# EAGLE design pico8enc (EAGLE 9.6.2)
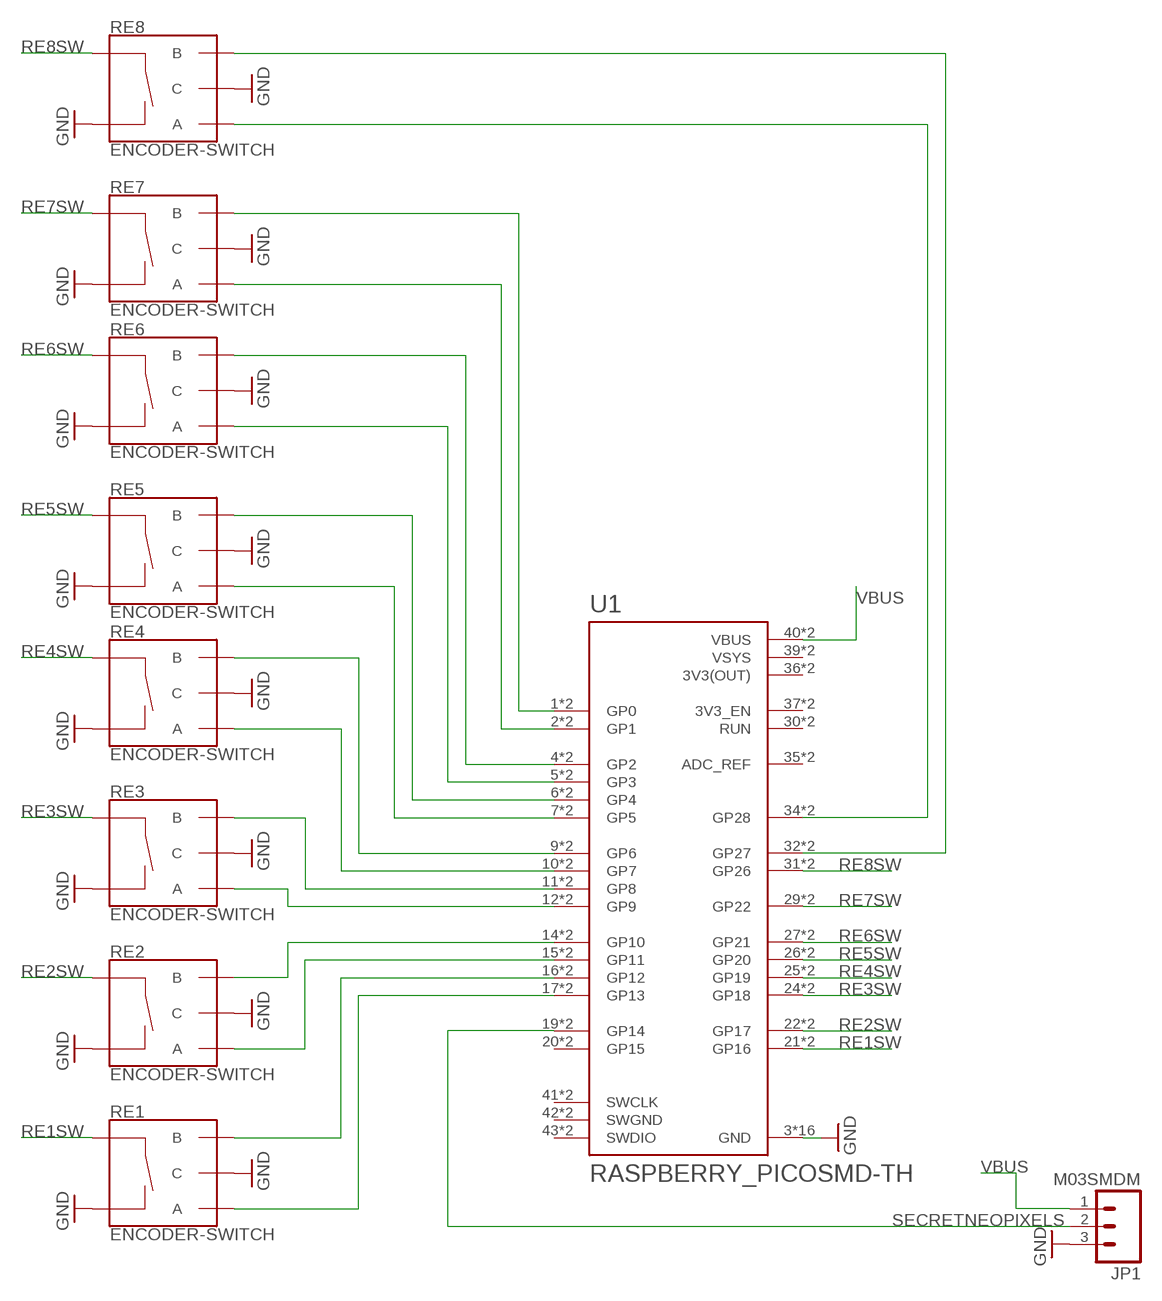
[diagram p0: schematic, sheet 1]

## Parts
JP1  M03SMDM  [1X03-SMD-MINIMAL]
RE1  ENCODER-SWITCH  [ROTARY_ENC_PLAIN]
RE2  ENCODER-SWITCH  [ROTARY_ENC_PLAIN]
RE3  ENCODER-SWITCH  [ROTARY_ENC_PLAIN]
RE4  ENCODER-SWITCH  [ROTARY_ENC_PLAIN]
RE5  ENCODER-SWITCH  [ROTARY_ENC_PLAIN]
RE6  ENCODER-SWITCH  [ROTARY_ENC_PLAIN]
RE7  ENCODER-SWITCH  [ROTARY_ENC_PLAIN]
RE8  ENCODER-SWITCH  [ROTARY_ENC_PLAIN]
U1  RASPBERRY_PICOSMD-TH  [PICO-PKG]

## Nets
GND: JP1.3 RE1.C RE1.SW- RE2.C RE2.SW- RE3.C RE3.SW- RE4.C RE4.SW- RE5.C RE5.SW- RE6.C RE6.SW- RE7.C RE7.SW- RE8.C RE8.SW- U1.3(GND) U1.8(GND) U1.13(GND) U1.18(GND) U1.23(GND) U1.28(GND) U1.33(GND) U1.38(GND) U1.P$3(GND) U1.P$8(GND) U1.P$13(GND) U1.P$18(GND) U1.P$23(GND) U1.P$28(GND) U1.P$33(GND) U1.P$38(GND)
N$1: RE1.A U1.17(GP13) U1.P$17(GP13)
N$2: RE1.B U1.16(GP12) U1.P$16(GP12)
N$3: RE2.A U1.15(GP11) U1.P$15(GP11)
N$4: RE2.B U1.14(GP10) U1.P$14(GP10)
N$5: RE3.A U1.12(GP9) U1.P$12(GP9)
N$6: RE3.B U1.11(GP8) U1.P$11(GP8)
N$7: RE4.A U1.10(GP7) U1.P$10(GP7)
N$8: RE4.B U1.9(GP6) U1.P$9(GP6)
N$9: RE5.A U1.7(GP5) U1.P$7(GP5)
N$10: RE5.B U1.6(GP4) U1.P$6(GP4)
N$11: RE6.A U1.5(GP3) U1.P$5(GP3)
N$12: RE6.B U1.4(GP2) U1.P$4(GP2)
N$13: RE7.A U1.2(GP1) U1.P$2(GP1)
N$14: RE7.B U1.1(GP0) U1.P$1(GP0)
N$15: RE8.A U1.34(GP28) U1.P$34(GP28)
N$16: RE8.B U1.32(GP27) U1.P$32(GP27)
RE1SW: RE1.SW+ U1.21(GP16) U1.P$21(GP16)
RE2SW: RE2.SW+ U1.22(GP17) U1.P$22(GP17)
RE3SW: RE3.SW+ U1.24(GP18) U1.P$24(GP18)
RE4SW: RE4.SW+ U1.25(GP19) U1.P$25(GP19)
RE5SW: RE5.SW+ U1.26(GP20) U1.P$26(GP20)
RE6SW: RE6.SW+ U1.27(GP21) U1.P$27(GP21)
RE7SW: RE7.SW+ U1.29(GP22) U1.P$29(GP22)
RE8SW: RE8.SW+ U1.31(GP26) U1.P$31(GP26)
SECRETNEOPIXELS: JP1.2 U1.19(GP14) U1.P$19(GP14)
VBUS: JP1.1 U1.40(VBUS) U1.P$40(VBUS)
Unconnected: U1.20(GP15) U1.30(RUN) U1.35(ADC_REF) U1.37(3V3_EN) U1.41(SWCLK) U1.43(SWDIO) U1.P$20(GP15) U1.P$30(RUN) U1.P$35(ADC_REF) U1.P$37(3V3_EN) U1.P$41(SWCLK) U1.P$43(SWDIO)

## Power pins joined to a net without a drawn wire
3V3(OUT): U1.36(3V3(OUT)) U1.P$36(3V3(OUT))
SWGND: U1.42(SWGND) U1.P$42(SWGND)
VSYS: U1.39(VSYS) U1.P$39(VSYS)

## Library data of the parts
JP1 = todstuff:M03
RE1-RE8 = SparkFun-Switches:ENCODER-SWITCH: Rotary Encoder w/ Select Switch Encoders rotate similarly to potentiometers, but they’re different from potentiometers in that an encoder has full rotation without limits. They output gray code so that you can tell how much and in which direction the encoder has been turned. This encoder includes a push-down select switch built into the shaft. SparkFun Products Rotary Encoder <https://www.sparkfun.com/products/9117> (COM-09117); SF_SKU: COM-09117
U1 = RpiPico:RASPBERRY_PICO: Raspberry Pi Pico

## Board
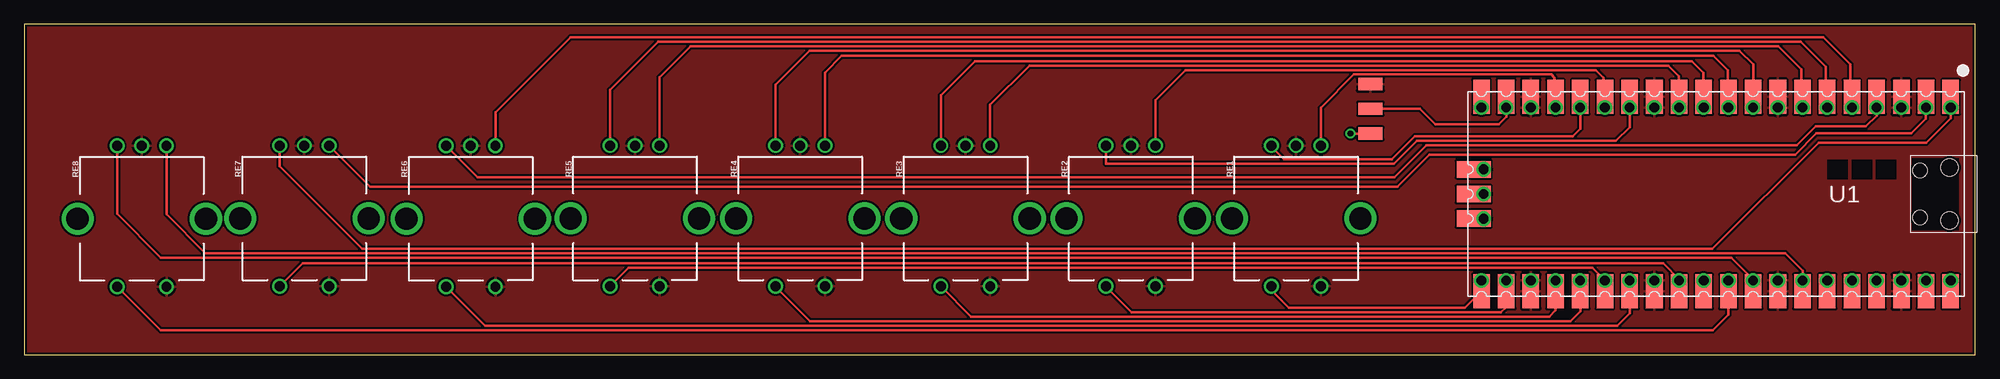
[diagram p1: board, top side]
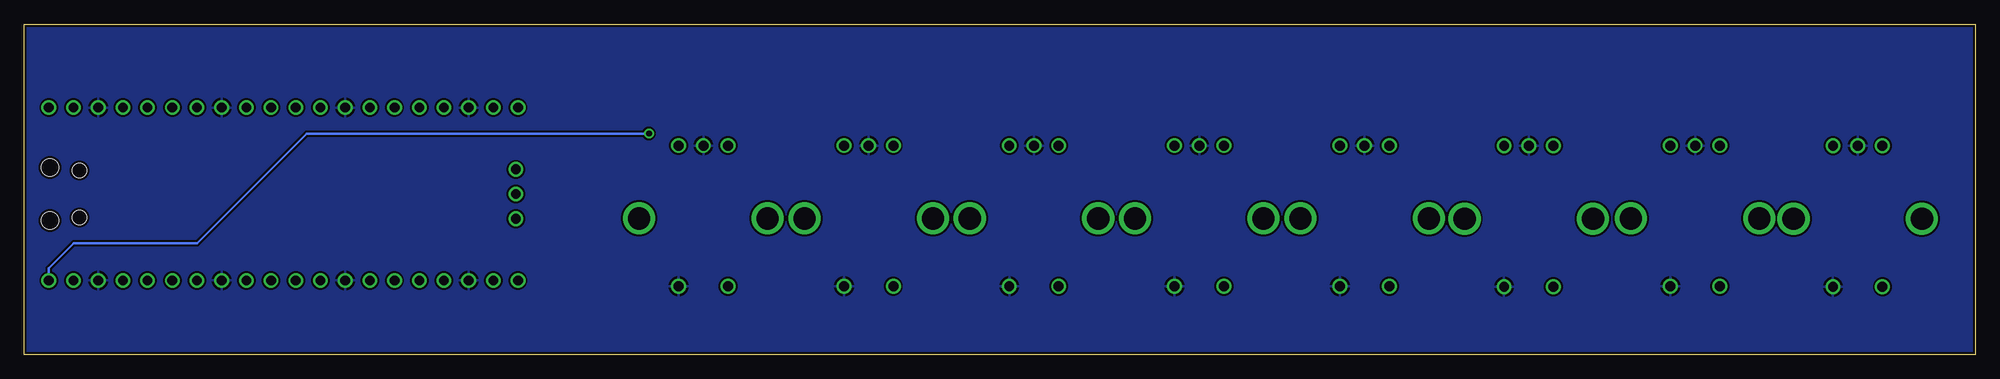
[diagram p2: board, bottom side, seen from below]

Size 200.64 x 33.96 mm. Coordinates in mm from the lower left corner, seen from the top.
Outline: 0,0 200.64,0 200.64,33.96 0,33.96 0,0
Copper layers (1*16): Top 0.035mm / dielectric 1.5mm / Bottom 0.035mm
Design rules "adafruit-rules-20180530 *": minimum track width 10mil, minimum drill 16mil, track to track 8mil, track to pad 8mil, pad to pad 8mil, via to via 8mil, smd to smd 8mil, copper to edge 10mil, drill to drill 8mil, minimum pad ring 10mil, minimum via ring 8mil, stop-mask expansion 4mil, vias tented up to drill 20mil, thermal gap 10mil

### Footprints (pad centres in the part's own frame; a part is rotated, then mirrored left to right if it is on the bottom)
1X03-SMD-MINIMAL = smd 1.27 x 2.5: 1 -2.54,-0.01; 2 0,-0.01; 3 2.54,-0.01
ROTARY_ENC_PLAIN = drill 1.016: A 7.493,-2.54; B 7.493,2.54; C 7.493,0; SW+ -6.985,2.54; SW- -6.985,-2.54 | drill 2.286: P$3 0,6.604; P$4 0,-6.604
PICO-PKG = drill 1: 1 -8.89,24.13; 2 -8.89,21.59; 3 -8.89,19.05; 4 -8.89,16.51; 5 -8.89,13.97; 6 -8.89,11.43; 7 -8.89,8.89; 8 -8.89,6.35; 9 -8.89,3.81; 10 -8.89,1.27; 11 -8.89,-1.27; 12 -8.89,-3.81; 13 -8.89,-6.35; 14 -8.89,-8.89; 15 -8.89,-11.43; 16 -8.89,-13.97; 17 -8.89,-16.51; 18 -8.89,-19.05; 19 -8.89,-21.59; 20 -8.89,-24.13; 21 8.89,-24.13; 22 8.89,-21.59; 23 8.89,-19.05; 24 8.89,-16.51; 25 8.89,-13.97; 26 8.89,-11.43; 27 8.89,-8.89; 28 8.89,-6.35; 29 8.89,-3.81; 30 8.89,-1.27; 31 8.89,1.27; 32 8.89,3.81; 33 8.89,6.35; 34 8.89,8.89; 35 8.89,11.43; 36 8.89,13.97; 37 8.89,16.51; 38 8.89,19.05; 39 8.89,21.59; 40 8.89,24.13; 41 -2.54,-23.9; 42 0,-23.9; 43 2.54,-23.9 | smd 3.5 x 1.7: P$1 -10,24.13; P$2 -10,21.59; P$3 -10,19.05; P$4 -10,16.51; P$5 -10,13.97; P$6 -10,11.43; P$7 -10,8.89; P$8 -10,6.35; P$9 -10,3.81; P$10 -10,1.27; P$11 -10,-1.27; P$12 -10,-3.81; P$13 -10,-6.35; P$14 -10,-8.89; P$15 -10,-11.43; P$16 -10,-13.97; P$17 -10,-16.51; P$18 -10,-19.05; P$19 -10,-21.59; P$20 -10,-24.13; P$21 10,-24.13; P$22 10,-21.59; P$23 10,-19.05; P$24 10,-16.51; P$25 10,-13.97; P$26 10,-11.43; P$27 10,-8.89; P$28 10,-6.35; P$29 10,-3.81; P$30 10,-1.27; P$31 10,1.27; P$32 10,3.81; P$33 10,6.35; P$34 10,8.89; P$35 10,11.43; P$36 10,13.97; P$37 10,16.51; P$38 10,19.05; P$39 10,21.59; P$40 10,24.13 | smd 1.7 x 3.5: P$41 -2.54,-24.925; P$42 0,-24.925; P$43 2.54,-24.925 | hole 1.8: -2.725,24; 2.725,24 | hole 1.5: -2.425,20.97; 2.425,20.97

### Placement (x,y rotation side)
JP1  138.43,25.27 90 top
RE1  130.8,14 90 top
RE2  113.8,14 90 top
RE3  96.8,14 90 top
RE4  79.8,14 90 top
RE5  62.8,14 90 top
RE6  45.91,13.97 90 top
RE7  28.8,14 90 top
RE8  12.08,13.97 90 top
U1  173.99,16.51 270 top

### Tracks (layer width: path | path; a pad name or v marks a point on that pad's centre or on a via)
3V3(OUT)
  Top 0.254: U1.P$36 U1.36
GND
  pour Top: 0,35.56 200.66,35.56 200.66,-3.81 0,-3.81
  pour Bottom: -1.27,38.1 201.93,38.1 201.93,-2.54 -1.27,-2.54
N$1
  Top 0.254: 157.61,25.6 157.61,26.34 157.46,26.49 U1.P$17 | 157.46,25.42 157.61,25.57 157.64,25.56 U1.P$17 | 157.38,26.51 157.38,28.47 157.05,28.8 136.75,28.8 133.34,25.39 RE1.A | 157.38,26.51 U1.P$17 | U1.17 U1.P$17 | U1.P$17 | U1.P$17 157.38,26.51
N$2
  Top 0.254: 160.12,26.29 160.12,25.55 160,25.43 U1.16 | 160.12,26.35 159.99,26.48 U1.P$16 U1.16 | U1.16 160.02,23.22 159.26,22.45 143,22.45 140.64,20.09 129.54,20.09 128.26,21.37 RE1.B
N$3
  Top 0.254: 162.6,25.4 162.64,25.6 162.64,26.29 162.62,26.36 | 162.62,26.36 162.6,26.51 | RE2.A 116.34,26.17 119.43,29.26 161.62,29.26 162.41,28.47 162.41,26.51 U1.P$15 | 162.62,26.36 162.56,26.35 U1.P$15 | U1.15 U1.P$15
N$4
  Top 0.254: 165.12,25.4 165.15,25.6 165.15,26.29 165.14,26.36 | 165.14,26.36 165.12,26.51 | RE2.B 111.26,19.63 140.87,19.63 143.23,22 163.7,22 165.1,23.39 U1.14 U1.P$14 165.1,26.35 165.14,26.36
N$5
  Top 0.254: U1.12 U1.P$12 170.18,28.6 169.06,29.72 103.38,29.72 99.34,25.68 RE3.A
N$6
  Top 0.254: 172.71,25.4 172.69,25.6 172.69,26.29 172.7,26.35 | 172.7,26.35 172.71,26.51 | 172.69,26.51 172.69,28.98 171.5,30.18 97.79,30.18 94.26,26.64 RE3.B | 172.69,26.51 U1.P$11 | 172.7,26.35 172.72,26.35 U1.P$11 | U1.11 U1.P$11 | U1.P$11 172.69,26.51
N$7
  Top 0.254: 175.24,25.4 175.21,25.6 175.21,26.29 175.22,26.36 | 175.22,26.36 175.24,26.51 | 175.21,26.51 175.21,29.23 173.71,30.73 84.07,30.73 82.34,29 RE4.A | 175.21,26.51 U1.P$10 | 175.22,26.36 175.26,26.35 U1.P$10 | U1.10 U1.P$10 | U1.P$10 175.21,26.51
N$8
  Top 0.254: U1.9 U1.P$9 177.8,29.84 176.4,31.24 80.77,31.24 77.26,27.73 RE4.B
N$9
  Top 0.254: 182.98,25.6 182.98,26.35 182.85,26.48 U1.P$7 | 182.85,25.43 182.98,25.55 183.04,25.56 U1.P$7 | RE5.A 65.34,28.51 68.53,31.7 180.42,31.7 182.75,29.36 182.75,26.51 U1.P$7 | U1.7 U1.P$7 | U1.P$7
N$10
  Top 0.254: 185.46,25.4 185.5,25.6 185.5,26.29 185.48,26.36 | 185.48,26.36 185.46,26.51 | RE5.B 60.26,27.24 65.18,32.16 182.73,32.16 185.27,29.62 185.27,26.51 U1.P$6 | 185.48,26.36 185.42,26.35 U1.P$6 | U1.6 U1.P$6
N$11
  Top 0.254: 187.99,25.4 188.01,25.6 188.01,26.29 188,26.36 | 188,26.36 187.99,26.51 | RE6.A 48.45,24.9 56.16,32.61 185.01,32.61 187.78,29.84 187.78,26.51 U1.P$5 | 188,26.36 187.96,26.35 U1.P$5 | U1.5 U1.P$5
N$12
  Top 0.254: 190.51,25.4 190.53,25.6 190.53,26.29 190.52,26.35 | 190.52,26.35 190.51,26.51 | 190.52,26.35 190.5,26.35 U1.P$4 U1.4 190.5,24.56 189.41,23.47 184.25,23.47 182.28,21.5 144.18,21.5 140.89,18.21 46.62,18.21 RE6.B
N$13
  Top 0.254: 195.57,25.4 195.56,25.6 195.56,26.29 195.56,26.35 | 195.56,26.35 195.57,26.51 | 195.56,26.35 195.58,26.35 U1.P$2 U1.2 195.58,24.26 194.08,22.76 184.3,22.76 182.12,20.57 144.53,20.57 141.22,17.27 35.56,17.27 RE7.A
N$14
  Top 0.254: 198.09,25.4 198.07,25.6 198.07,26.29 198.08,26.36 | 198.08,26.36 198.09,26.51 | 198.08,26.36 198.12,26.35 U1.P$1 U1.1 198.12,24.28 195.63,21.79 184.53,21.79 173.61,10.87 34.76,10.87 26.26,19.37 RE7.B
N$15
  Top 0.254: RE8.A 14.62,14.41 18.62,10.41 181.1,10.41 182.89,8.63 U1.34 U1.P$34
N$16
  Top 0.254: RE8.B 9.54,14.46 14.04,9.96 175.54,9.96 177.8,7.7 U1.32 U1.P$32
RE1SW
  Top 0.254: RE1.SW+ 128.26,6.61 130.04,4.83 148.18,4.83 U1.P$21 U1.21
RE2SW
  Top 0.254: 152.35,7.56 U1.22 U1.P$22 152.4,4.88 151.87,4.34 113.89,4.34 111.26,6.97 RE2.SW+
RE3SW
  Top 0.254: RE3.SW+ 97.39,3.89 156.82,3.89 157.48,4.55 U1.P$24 U1.24
RE4SW
  Top 0.254: RE4.SW+ 77.26,6.97 80.8,3.43 159,3.43 160.02,4.45 U1.P$25 U1.25
RE5SW
  Top 0.254: RE5.SW+ 62.16,8.91 161.26,8.91 U1.26 U1.P$26
RE6SW
  Top 0.254: U1.27 U1.P$27 165.1,4.24 163.83,2.97 47.38,2.97 RE6.SW+
RE7SW
  Top 0.254: U1.P$29 U1.29 170.18,7.77 168.58,9.37 28.62,9.37 RE7.SW+
RE8SW
  Top 0.254: RE8.SW+ 14.04,2.49 173.63,2.49 175.26,4.12 U1.P$31 U1.31
SECRETNEOPIXELS
  Top 0.254: JP1.2 143.51,25.27 145.11,23.67 151.64,23.67 152.4,24.43 U1.19 U1.P$19
SWGND
  Top 0.254: U1.P$42 U1.42
VBUS  (via drill 0.6)
  Top 0.254: JP1.1 v136.4,22.73 | U1.P$40 U1.40
  Bottom 0.254: v136.4,22.73 171.58,22.73 182.88,11.43 195.58,11.43 198.12,8.89 U1.40
VSYS
  Top 0.254: U1.P$39 U1.39